# EAGLE design ethernet_io (EAGLE 5.11)

## Sheet 1 of 2
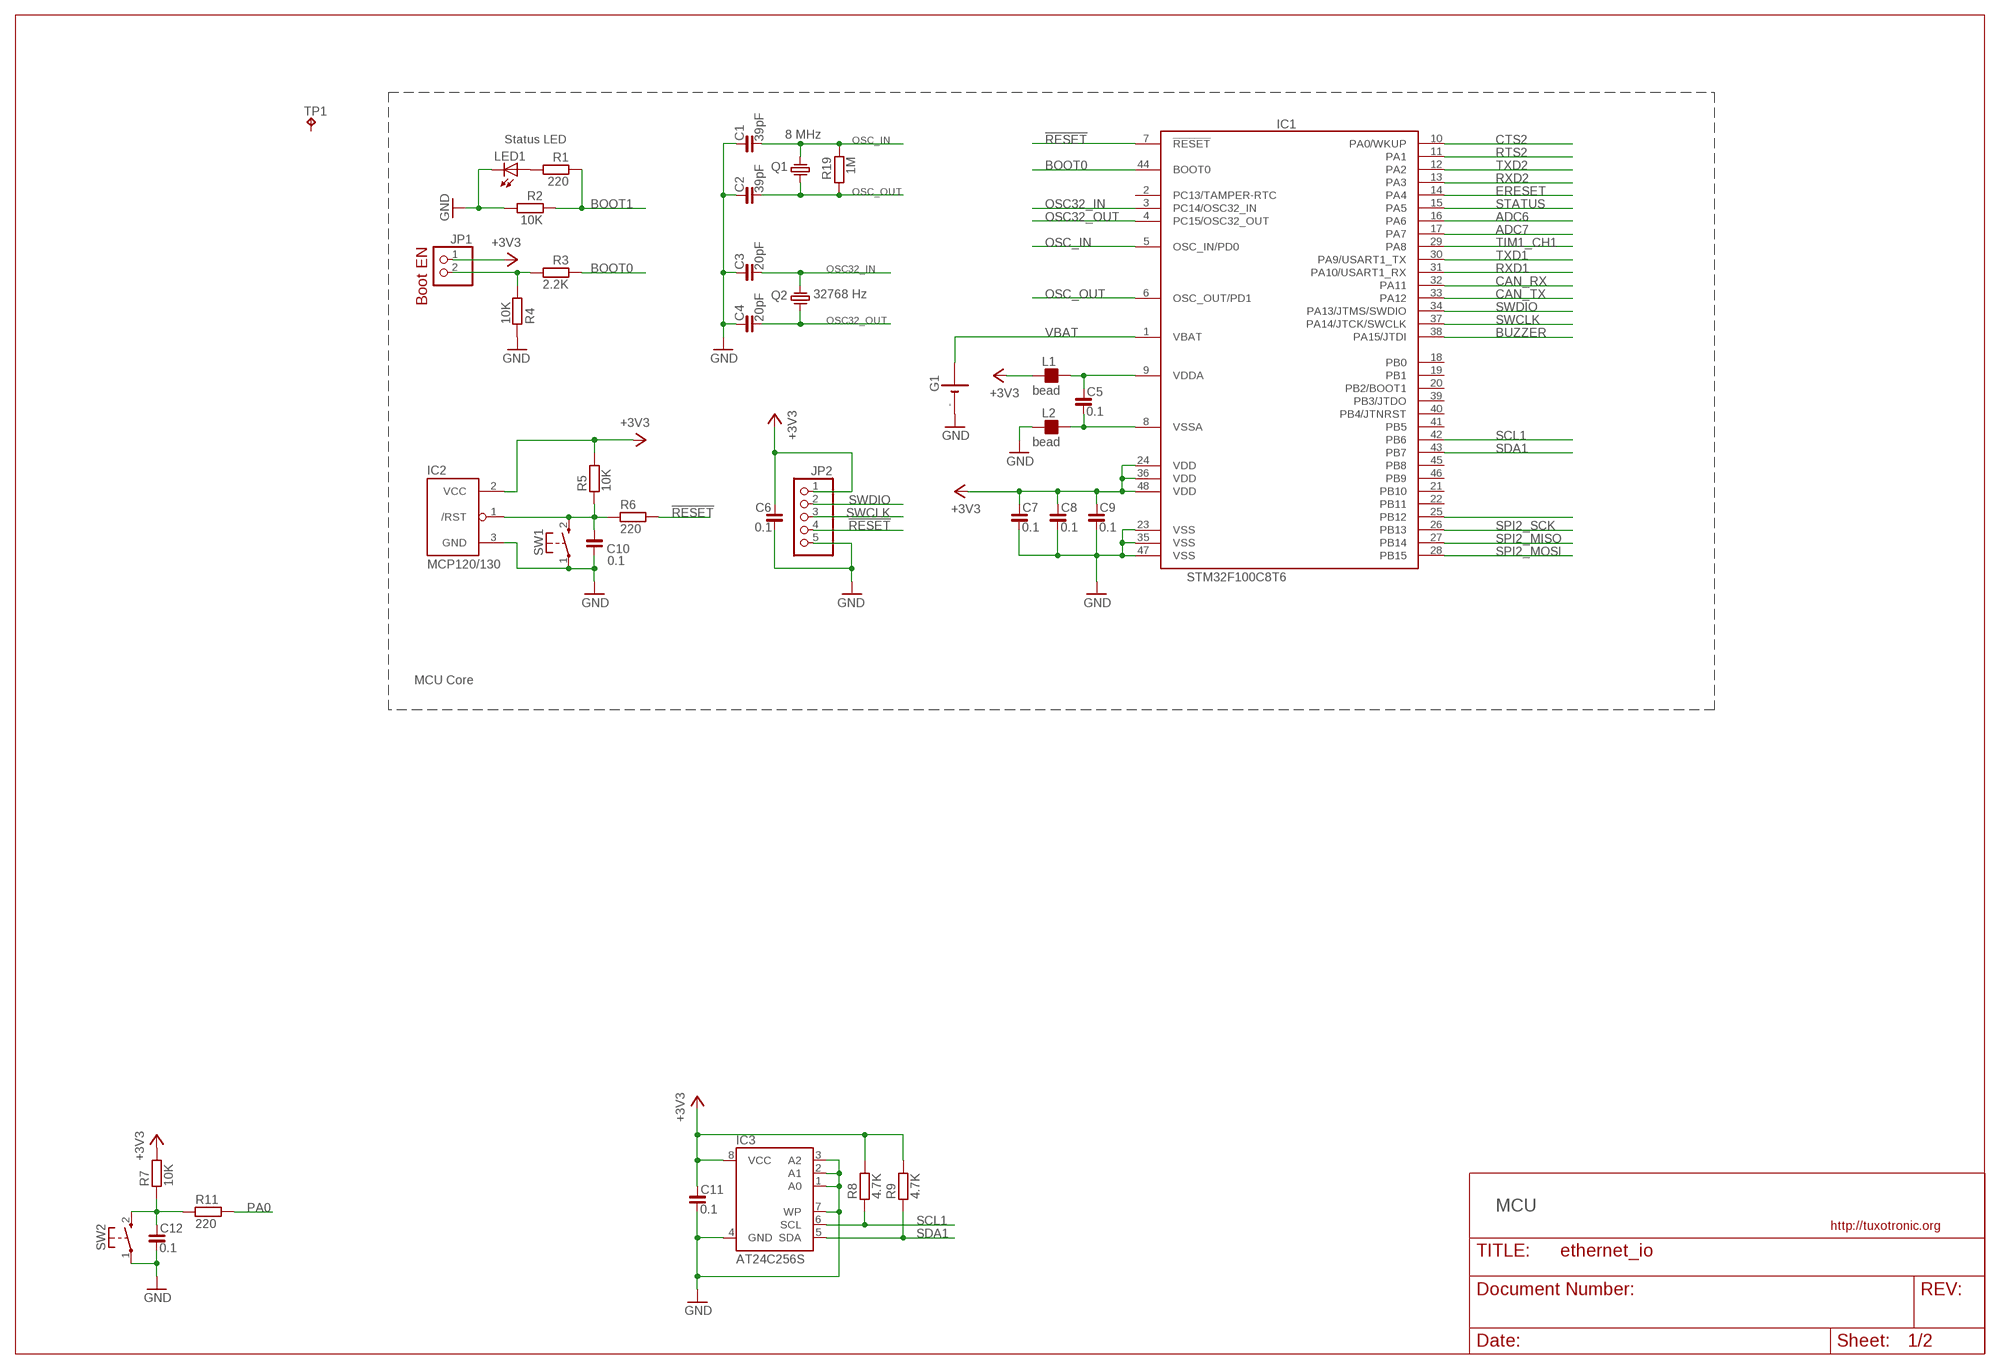
[diagram p0: schematic, sheet 1]

### Parts
C1  39pF  C_0603  [C0603]
C2  39pF  C_0603  [C0603]
C3  20pF  C_0603  [C0603]
C4  20pF  C_0603  [C0603]
C5  0.1  C_0603  [C0603]
C6  0.1  C_0603  [C0603]
C7  0.1  C_0603  [C0603]
C8  0.1  C_0603  [C0603]
C9  0.1  C_0603  [C0603]
C10  0.1  C_0603  [C0603]
C11  0.1  C_0603  [C0603]
C12  0.1  C_0603  [C0603]
G1  LI3VHOLDER  [LITHOLDER]
IC1  STM32F100C8T6  STM32F103C8T6  [LQFP48]
IC2  MCP120/130  [SOT23]
IC3  AT24C256S  [SO08]
JP1  PINHD-1X2_2.00  [1X02M]
JP2  PINHD-1X5_2.00  [1X05M]
L1  bead  FB_0603  [L0603]
L2  bead  FB_0603  [L0603]
LED1  LEDCHIP-LED0805  [CHIP-LED0805]
Q1  8 MHz  CRYSTAL-HC49S  [HC49/S]
Q2  32768 Hz  CRYSTAL-TC38H  [TC38H]
R1  220  R_0603  [R0603]
R2  10K  R_0603  [R0603]
R3  2.2K  R_0603  [R0603]
R4  10K  R_0603  [R0603]
R5  10K  R_0603  [R0603]
R6  220  R_0603  [R0603]
R7  10K  R_0603  [R0603]
R8  4.7K  R_0603  [R0603]
R9  4.7K  R_0603  [R0603]
R11  220  R_0603  [R0603]
R19  1M  R_0603  [R0603]
SW1  KSS-2EG4430  [KSS-2EG4430]
SW2  KSS-2EG4430  [KSS-2EG4430]
TP1  TPB1,27  [B1,27]

### Nets
!RESET: IC1.7(!RESET) JP2.4 R6.2
+3V3: C6.1 C7.1 C8.1 C9.1 C11.1 IC1.24(VDD) IC1.36(VDD) IC1.48(VDD) IC2.2(VCC) IC3.8(VCC) JP1.1 JP2.1 L1.1 R5.2 R7.2 R8.2 R9.2 ; also sheet 2
ADC6: IC1.16(PA6)
ADC7: IC1.17(PA7)
BOOT0: IC1.44(BOOT0) R3.1
BOOT1: R1.1 R2.1
BUZZER: IC1.38(PA15/JTDI)
CAN_RX: IC1.32(PA11) ; also sheet 2
CAN_TX: IC1.33(PA12) ; also sheet 2
CTS2: IC1.10(PA0/WKUP) ; also sheet 2
ERESET: IC1.14(PA4) ; also sheet 2
GND: C1.1 C2.1 C3.1 C4.1 C6.2 C7.2 C8.2 C9.2 C10.2 C11.2 C12.2 G1.- IC1.23(VSS) IC1.35(VSS) IC1.47(VSS) IC2.3(GND) IC3.1(A0) IC3.2(A1) IC3.3(A2) IC3.4(GND) IC3.7(WP) JP2.5 L2.1 LED1.C R2.2 R4.1 SW1.1(P) SW2.1(P) ; also sheet 2
N$11: C10.1 IC2.1(/RST) R5.1 R6.1 SW1.2(S)
N$12: JP1.2 R3.2 R4.2
N$14: IC1.25(PB12)
N$17: C12.1 R7.1 R11.1 SW2.2(S)
N$30: LED1.A R1.2
OSC32_IN: C3.2 IC1.3(PC14/OSC32_IN) Q2.2
OSC32_OUT: C4.2 IC1.4(PC15/OSC32_OUT) Q2.1
OSC_IN: C1.2 IC1.5(OSC_IN/PD0) Q1.2 R19.1
OSC_OUT: C2.2 IC1.6(OSC_OUT/PD1) Q1.1 R19.2
PA0: R11.2
RTS2: IC1.11(PA1) ; also sheet 2
RXD1: IC1.31(PA10/USART1_RX) ; also sheet 2
RXD2: IC1.13(PA3) ; also sheet 2
SCL1: IC1.42(PB6) IC3.6(SCL) R8.1
SDA1: IC1.43(PB7) IC3.5(SDA) R9.1
SPI2_MISO: IC1.27(PB14)
SPI2_MOSI: IC1.28(PB15)
SPI2_SCK: IC1.26(PB13)
STATUS: IC1.15(PA5) ; also sheet 2
SWCLK: IC1.37(PA14/JTCK/SWCLK) JP2.3
SWDIO: IC1.34(PA13/JTMS/SWDIO) JP2.2
TIM1_CH1: IC1.29(PA8)
TXD1: IC1.30(PA9/USART1_TX) ; also sheet 2
TXD2: IC1.12(PA2) ; also sheet 2
VBAT: G1.+ IC1.1(VBAT)
VDDA: C5.1 IC1.9(VDDA) L1.2
VSSA: C5.2 IC1.8(VSSA) L2.2
Unconnected: IC1.2(PC13/TAMPER-RTC) IC1.18(PB0) IC1.19(PB1) IC1.20(PB2/BOOT1) IC1.21(PB10) IC1.22(PB11) IC1.39(PB3/JTDO) IC1.40(PB4/JTNRST) IC1.41(PB5) IC1.45(PB8) IC1.46(PB9) TP1.PP(TP)

### Notes on the sheet
- Status LED
- Boot EN
- MCU Core
- MCU

## Sheet 2 of 2
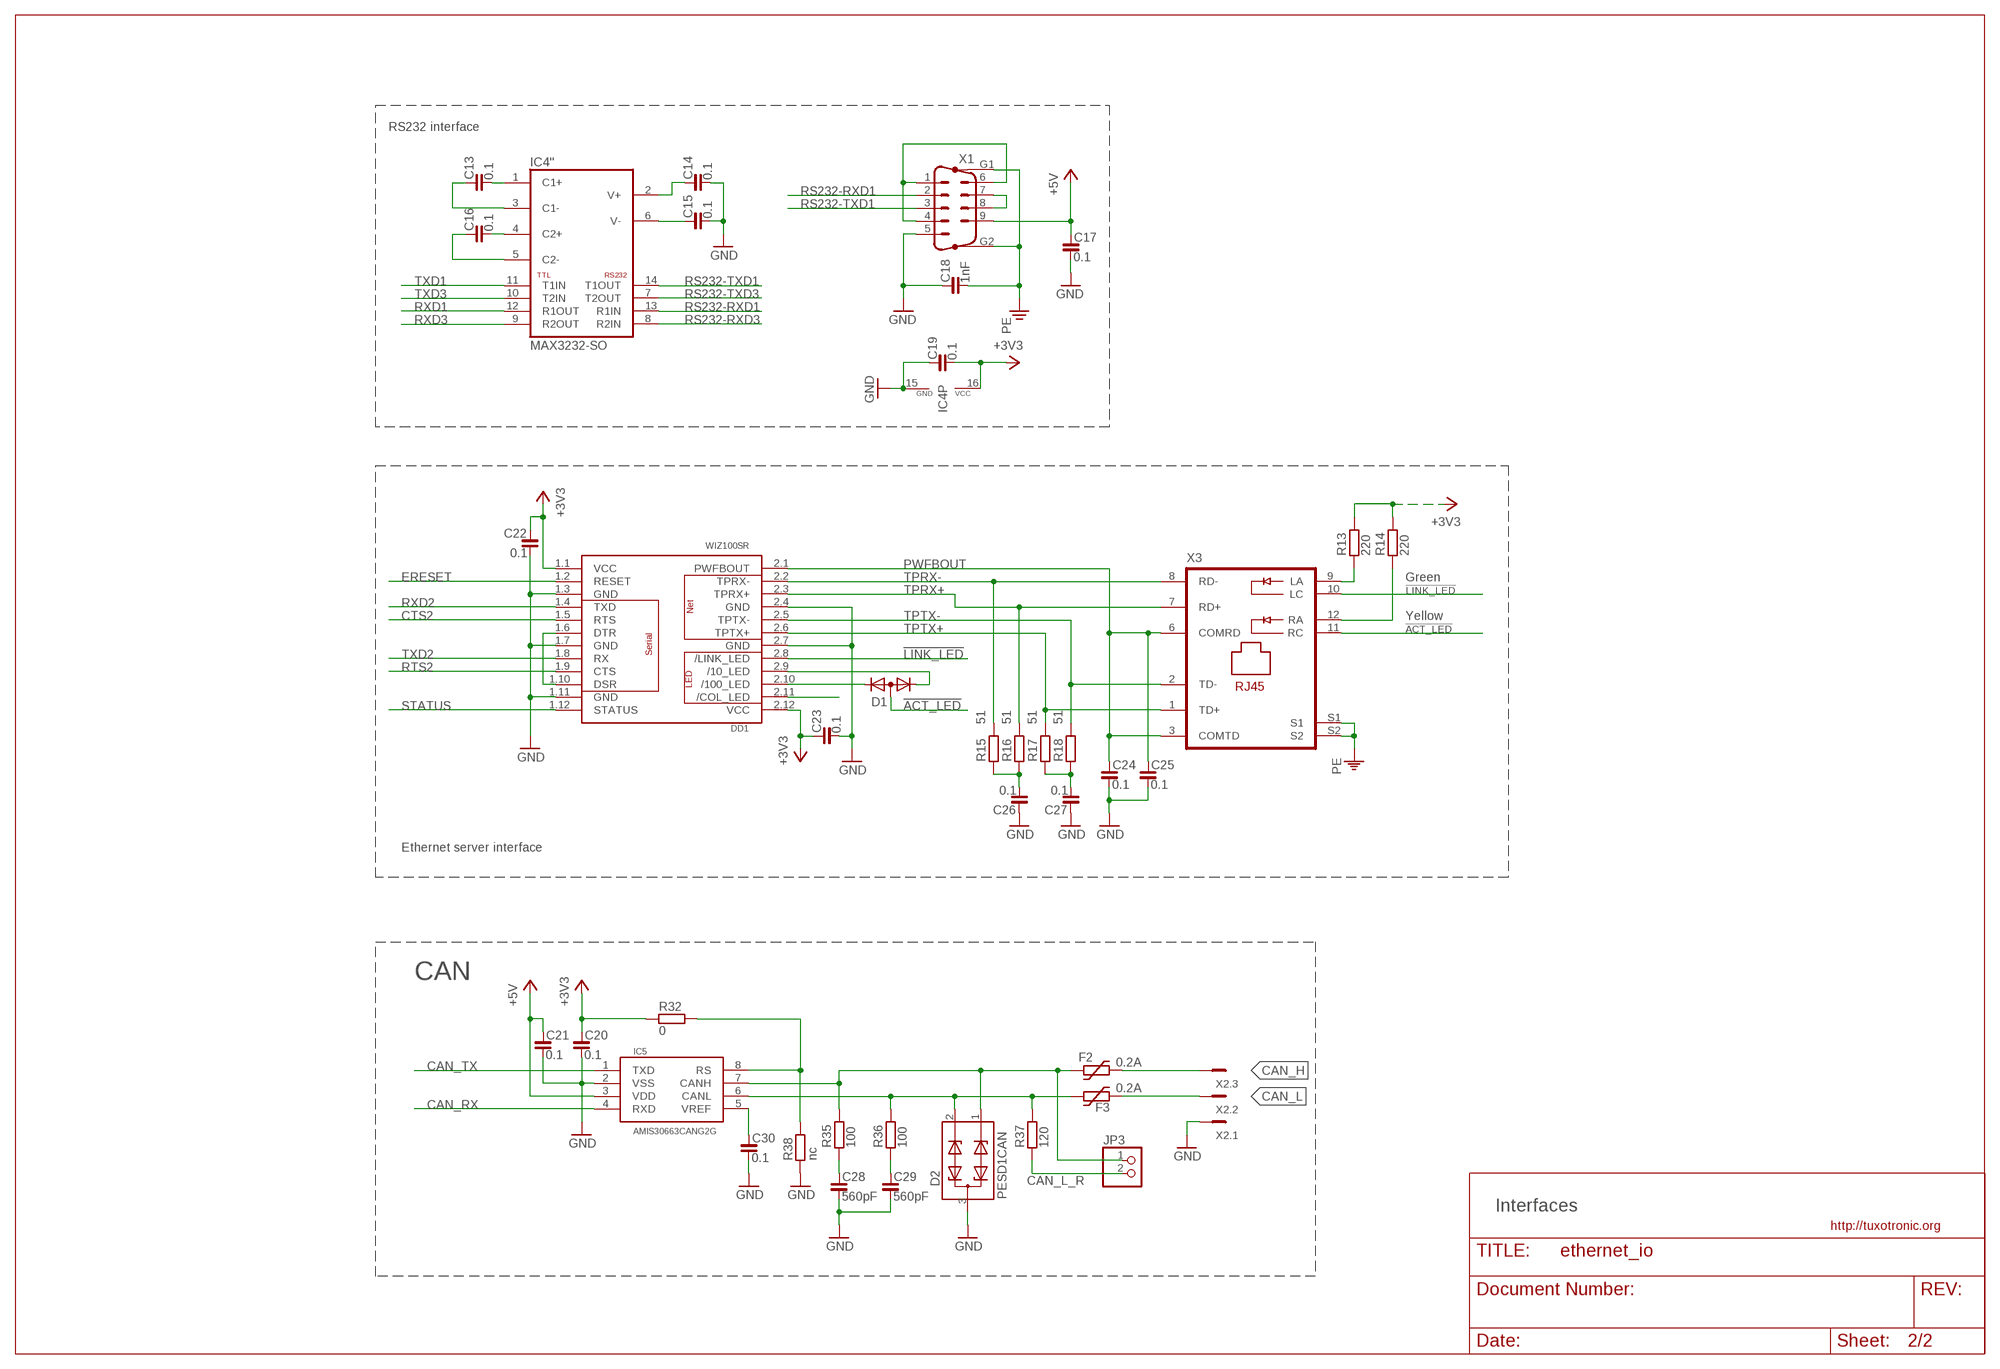
[diagram p1: schematic, sheet 2]

### Parts
C13  0.1  C_0603  [C0603]
C14  0.1  C_0603  [C0603]
C15  0.1  C_0603  [C0603]
C16  0.1  C_0603  [C0603]
C17  0.1  C_0805  [C0805]
C18  1nF  C_1206  [C1206]
C19  0.1  C_0603  [C0603]
C20  0.1  C_0603  [C0603]
C21  0.1  C_0603  [C0603]
C22  0.1  C_0603  [C0603]
C23  0.1  C_0603  [C0603]
C24  0.1  C_0603  [C0603]
C25  0.1  C_0603  [C0603]
C26  0.1  C_0603  [C0603]
C27  0.1  C_0603  [C0603]
C28  560pF  C_0603  [C0603]
C29  560pF  C_0603  [C0603]
C30  0.1  C_0603  [C0603]
D1  DIODE_CA-AC__  [SOT23C]
D2  PESD1CAN  [SOT23]
DD1  WIZ100SR  [WIZ100SR]
F2  0.2A  1812L  [1812L]
F3  0.2A  1812L  [1812L]
IC4  MAX3232-SO  MAX232-SO  [SO16]
IC5  AMIS30663CANG2G  SN65HVD230  [SO08]
JP3  PINHD-1X2_2.00  [1X02M]
R13  220  R_0603  [R0603]
R14  220  R_0603  [R0603]
R15  51  R_0603  [R0603]
R16  51  R_0603  [R0603]
R17  51  R_0603  [R0603]
R18  51  R_0603  [R0603]
R32  0  R_0603  [R0603]
R35  100  R_0603  [R0603]
R36  100  R_0603  [R0603]
R37  120  R_0805  [R0805]
R38  nc  R_0603  [R0603]
X1  M09HP-9.4  [M09HP]
X2  MC3  [MC3]
X3  LU1T516-43-LF  [PJ-J0]

### Nets
!ACT_LED: D1.3(A) X3.11(RC)
!LINK_LED: DD1.2.8(/LINK_LED) X3.10(LC)
+3V3: C19.2 C20.1 C22.1 C23.1 DD1.1.1(VCC) DD1.2.12(VCC) IC4.16(P:VCC) R13.2 R14.2 R32.1 ; also sheet 1
+5V: C17.1 C21.1 IC5.3(VDD) X1.9
CAN_CTRL: IC5.8(RS) R32.2 R38.2
CAN_H: F2.P$2 X2.3
CAN_L: F3.P$2 X2.2
CAN_L_R: JP3.2 R37.1
CAN_RX: IC5.4(RXD) ; also sheet 1
CAN_TX: IC5.1(TXD) ; also sheet 1
CTS2: DD1.1.5(RTS) ; also sheet 1
ERESET: DD1.1.2(RESET) ; also sheet 1
GND: C14.2 C15.2 C17.2 C18.1 C19.1 C20.2 C21.2 C22.2 C23.2 C24.2 C25.2 C26.1 C27.1 C28.2 C29.2 C30.2 D2.3 DD1.1.3(GND) DD1.1.7(GND) DD1.1.11(GND) DD1.2.4(GND) DD1.2.7(GND) IC4.15(P:GND) IC5.2(VSS) R38.1 X1.5 X2.1 ; also sheet 1
N$1: C26.2 R15.1 R16.1
N$2: C27.2 R17.1 R18.1
N$3: D1.2(K2) DD1.2.9(/10_LED)
N$4: D1.1(K1) DD1.2.10(/100_LED)
N$5: X1.7 X1.8
N$6: X1.1 X1.4 X1.6
N$9: R13.1 X3.9(LA)
N$10: R14.1 X3.12(RA)
N$15: DD1.1.6(DTR) DD1.1.10(DSR)
N$16: DD1.2.11(/COL_LED)
N$18: C30.1 IC5.5(VREF)
N$51: D2.1 F2.P$1 IC5.7(CANH) JP3.1 R35.2
N$52: D2.2 F3.P$1 IC5.6(CANL) R36.2 R37.2
N$54: C29.1 R36.1
N$55: C28.1 R35.1
N$80: C14.1 IC4.2('':V+)
N$81: C15.1 IC4.6('':V-)
N$82: C16.1 IC4.5('':C2-)
N$83: C16.2 IC4.4('':C2+)
N$84: C13.1 IC4.3('':C1-)
N$85: C13.2 IC4.1('':C1+)
PE: C18.2 X1.G1 X1.G2 X3.S1 X3.S2
PWFBOUT: C24.1 C25.1 DD1.2.1(PWFBOUT) X3.3(COMTD) X3.6(COMRD)
RS232-RXD1: IC4.13('':R1IN) X1.2
RS232-RXD3: IC4.8('':R2IN)
RS232-TXD1: IC4.14('':T1OUT) X1.3
RS232-TXD3: IC4.7('':T2OUT)
RTS2: DD1.1.9(CTS) ; also sheet 1
RXD1: IC4.12('':R1OUT) ; also sheet 1
RXD2: DD1.1.4(TXD) ; also sheet 1
RXD3: IC4.9('':R2OUT)
STATUS: DD1.1.12(STATUS) ; also sheet 1
TPRX+: DD1.2.3(TPRX+) R16.2 X3.7(RD+)
TPRX-: DD1.2.2(TPRX-) R15.2 X3.8(RD-)
TPTX+: DD1.2.6(TPTX+) R17.2 X3.1(TD+)
TPTX-: DD1.2.5(TPTX-) R18.2 X3.2(TD-)
TXD1: IC4.11('':T1IN) ; also sheet 1
TXD2: DD1.1.8(RX) ; also sheet 1
TXD3: IC4.10('':T2IN)

### Notes on the sheet
- RS232 interface
- Green
- Yellow
- Ethernet server interface
- CAN
- Interfaces

## Library data of the parts
C1-C30 = rc-master-smd:C_: NON-POLARIZED CAP
D1 = semicon-smd-ipc:DIODE_CA-AC_: DUAL DIODE
D2 = protect:PESD1CAN: Features Due to the integrated diode structure only one small SOT23 package is needed to protect two CAN bus lines Max. peak pulse power: PPP = 200 W at tp = 8/20 ?s Low clamping voltage: VCL = 40 V at IPP = 1 A Ultra low leakage current: IRM < 1 nA ESD protection up to 23 kV IEC 61000-4-2, level 4 (ESD) IEC 61000-4-5 (surge); IPP = 3 A at tp = 8/20 ?s Small SMD plastic package Applications CAN bus protection Automotive applications
DD1 = wiznet:WIZ100SR: Ethernet to Serial mezzanine module
F2 F3 = discrete:1812L
G1 = battery:LI3VHOLDER
IC1 = stm32-2:STM32F103C: Medium-density performance line ARM-based 32-bit MCU with 64 or 128 KB Flash, USB, CAN, 7 timers, 2 ADCs, 9 communication interfaces
IC2 = mcp120-130:MCP120/130
IC3 = stm32-by-pb:AT24C*: 2-wire serial EEPROM
IC4 = rs232-rs485:MAX232: RS232 TRANSEIVER
IC5 = interfaces:SN65HVD230: CAN PHY driver
JP1 JP3 = pinhead-fixdrills:PINHD-1X2: PIN HEADER
JP2 = pinhead-fixdrills:PINHD-1X5: PIN HEADER
L1 L2 = rc-master-smd:FB_: FERRITE BEAD
LED1 = led:LED: LED OSRAM: - CHIPLED LG R971, LG N971, LY N971, LG Q971, LY Q971, LO R971, LY R971 LH N974, LH R974 LS Q976, LO Q976, LY Q976 LO Q996 - Hyper CHIPLED LW Q18S LB Q993, LB Q99A, LB R99A - SideLED LS A670, LO A670, LY A670, LG A670, LP A670 LB A673, LV A673, LT A673, LW A673 LH A674 LY A675 LS A676, LA A676, LO A676, LY A676, LW A676 LS A679, LY A679, LG A679 - Hyper Micro SIDELED® LS Y876, LA Y876, LO Y876, LY Y876 LT Y87S - SmartLED LW L88C, LW L88S LB L89C, LB L89S, LG L890 LS L89K, LO L89K, LY L89K LS L896, LA L896, LO L896, LY L896 - TOPLED LS T670, LO T670, LY T670, LG T670, LP T670 LSG T670, LSP T670, LSY T670, LOP T670, LYG T670 LG T671, LOG T671, LSG T671 LB T673, LV T673, LT T673, LW T673 LH T674 LS T676, LA T676, LO T676, LY T676, LB T676, LH T676, LSB T676, LW T676 LB T67C, LV T67C, LT T67C, LS T67K, LO T67K, LY T67K, LW E67C LS E67B, LA E67B, LO E67B, LY E67B, LB E67C, LV E67C, LT E67C LW T67C LS T679, LY T679, LG T679 LS T770, LO T770, LY T770, LG T770, LP T770 LB T773, LV T773, LT T773, LW T773 LH T774 LS E675, LA E675, LY E675, LS T675 LS T776, LA T776, LO T776, LY T776, LB T776 LHGB T686 LT T68C, LB T68C - Hyper Mini TOPLED® LB M676 - Mini TOPLED Santana® LG M470 LS M47K, LO M47K, LY M47K Source: http://www.osram.convergy.de - LUMILED® LXK2-PW12-R00, LXK2-PW12-S00, LXK2-PW14-U00, LXK2-PW14-V00 LXK2-PM12-R00, LXK2-PM12-S00, LXK2-PM14-U00 LXK2-PE12-Q00, LXK2-PE12-R00, LXK2-PE12-S00, LXK2-PE14-T00, LXK2-PE14-U00 LXK2-PB12-K00, LXK2-PB12-L00, LXK2-PB12-M00, LXK2-PB14-N00, LXK2-PB14-P00, LXK2-PB14-Q00 LXK2-PR12-L00, LXK2-PR12-M00, LXK2-PR14-Q00, LXK2-PR14-R00 LXK2-PD12-Q00, LXK2-PD12-R00, LXK2-PD12-S00 LXK2-PH12-R00, LXK2-PH12-S00 LXK2-PL12-P00, LXK2-PL12-Q00, LXK2-PL12-R00 Source: www.luxeon.com
Q1 Q2 = crystal:CRYSTAL-: CRYSTAL
R1-R9 R11 R13-R19 R32 R35-R38 = rc-master-smd:R_: RESISTOR
SW1 SW2 = buttons:KSS-2EG4430: Size: 3x6mm Height: 5mm from PCB Rating: DC12v 50mA Travel: 0.25±0.10mm Operating Force: 180±50gf Return Force: 60gf min Contact resistance: 100m? max Insulation resistance: 100M? min Operating life?50,000 cycles
TP1 = testpad:TP: Test pad
X1 = sub-d:M09HP: SUB-D
X2 = con-phoenix-381_l:MC3: Mini-Combicon 3.81mm horizontal 3-polig (ohne Gegenstecker)
X3 = con-magjack:LU1T516-43-LF: 8P8C (RJ-45) MagJack connector Can be replaced with LU1T041X

## Net classes
0 default: width 0.1 mm, drill 0.1 mm, clearance 0.1 mm

## Board
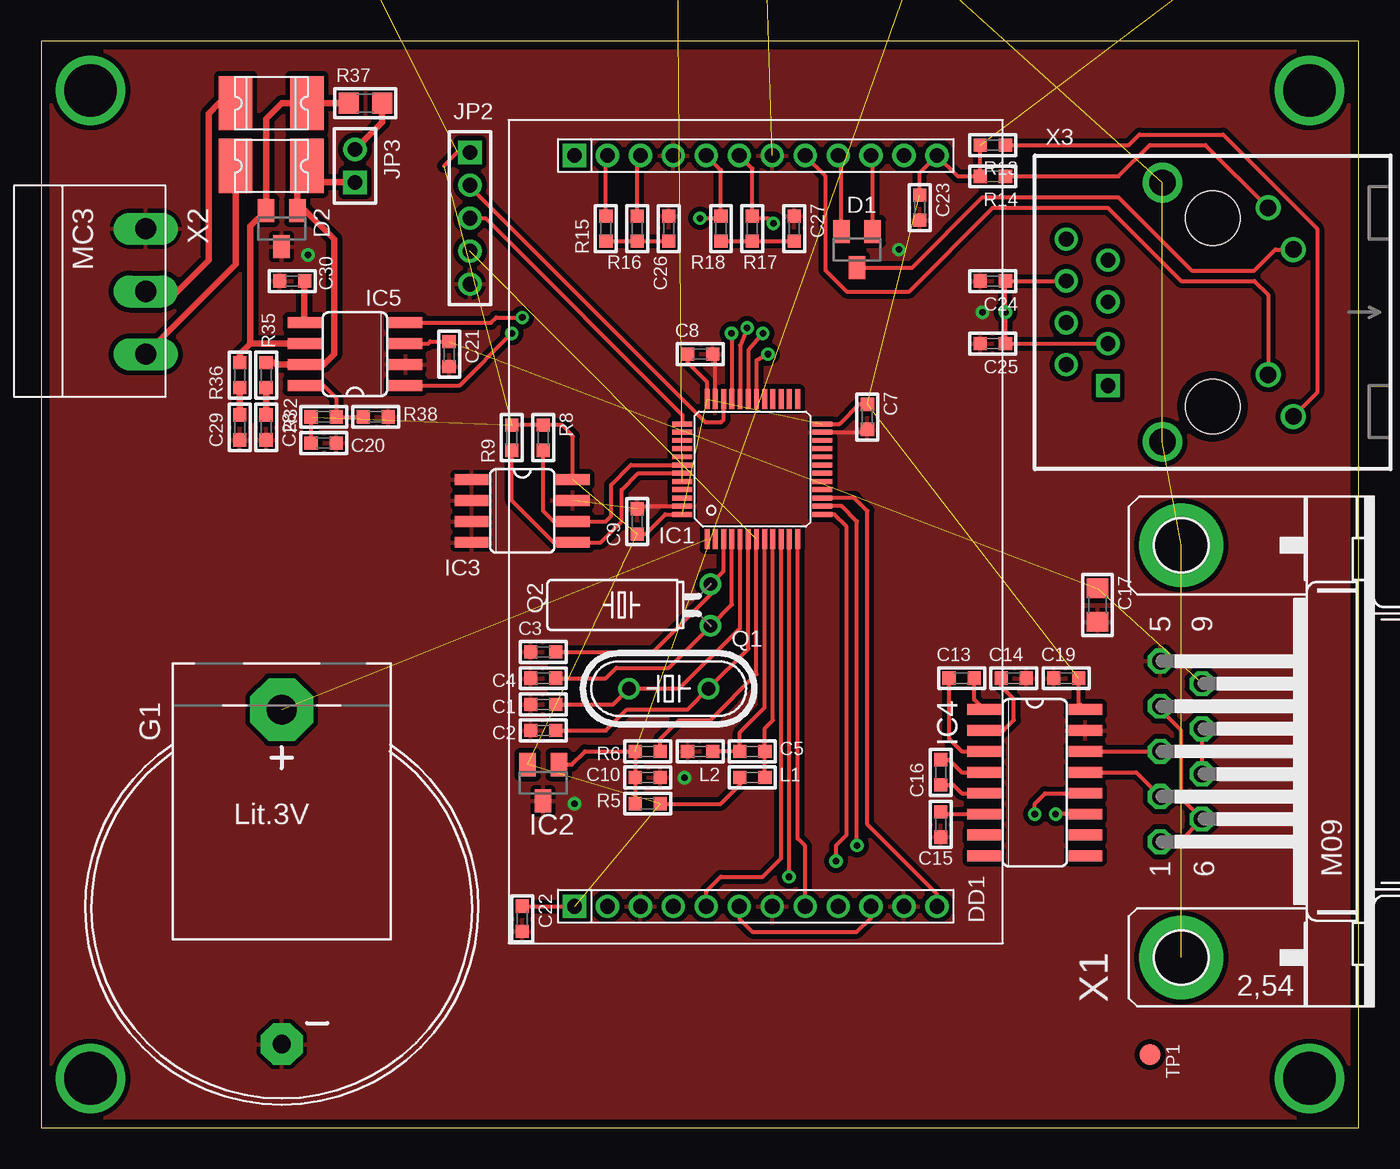
[diagram p2: board, top side]
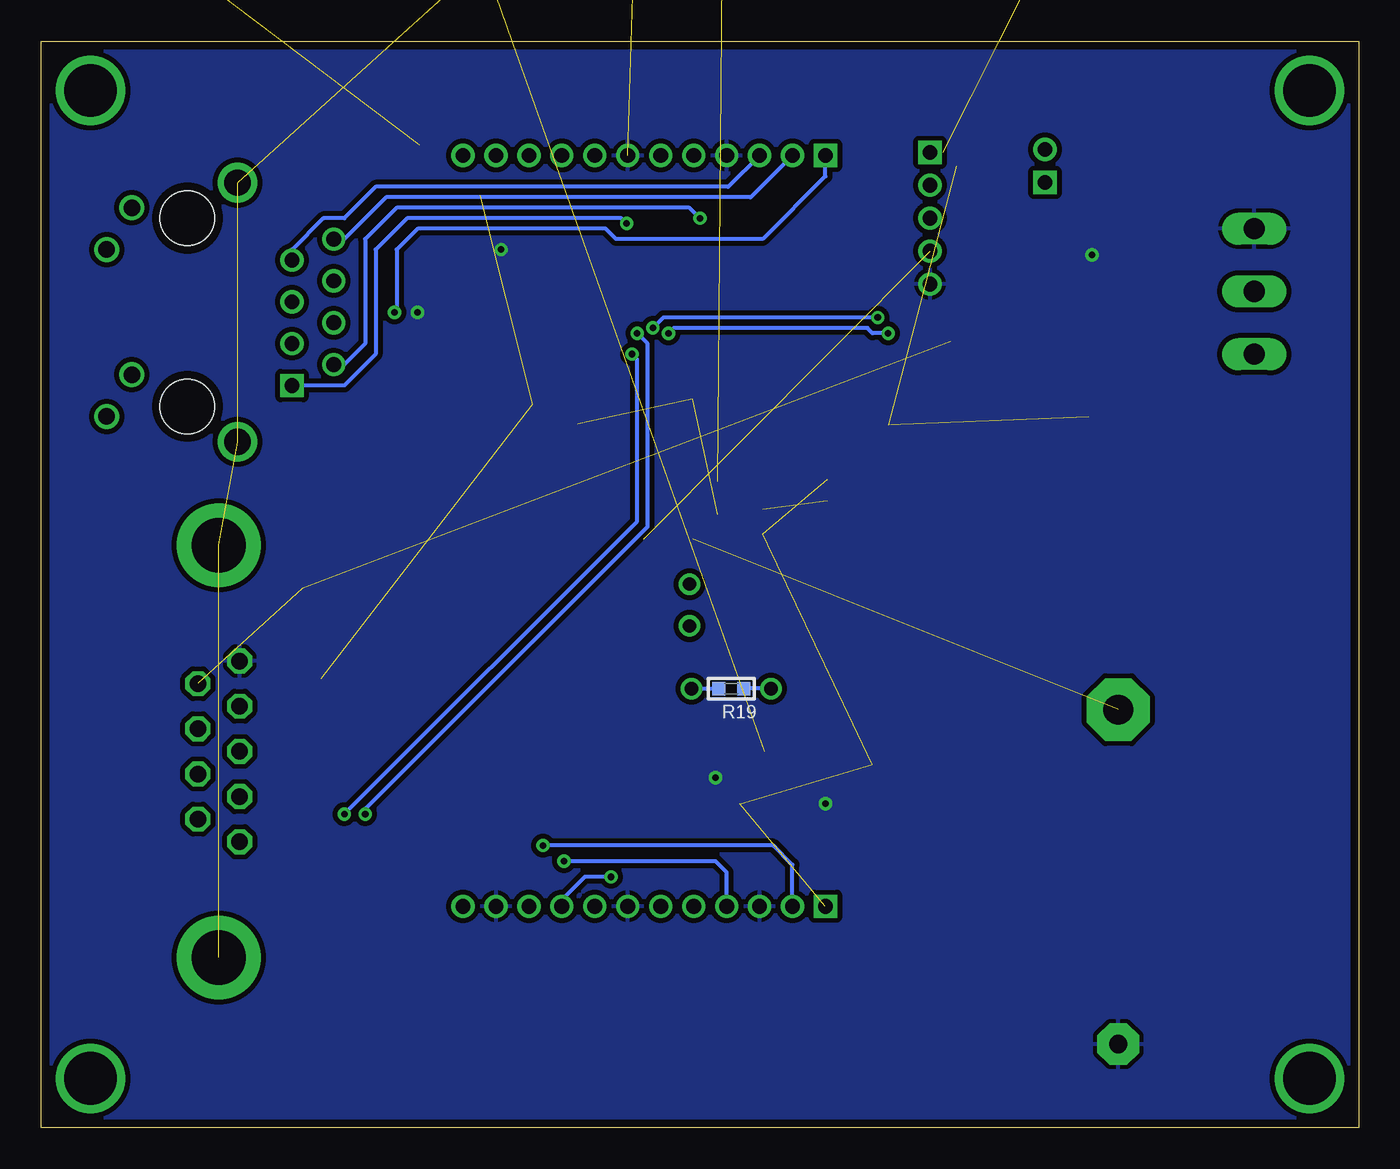
[diagram p3: board, bottom side, seen from below]

Size 80 x 66 mm. Coordinates in mm from the lower left corner, seen from the top.
Outline: 0,0 80,0 80,66 0,66 0,0
Copper layers (1*16): Top 0.018mm / dielectric 1.5mm / Bottom 0.018mm
Design rules "resonit-18mkm": minimum track width 0.16mm, minimum drill 0.4mm, track to track 0.16mm, track to pad 0.16mm, pad to pad 0.16mm, via to via 0.16mm, smd to smd 0.16mm, copper to edge 0.5mm, drill to drill 8mil, minimum pad ring 10mil, minimum via ring 8mil, stop-mask expansion 4mil, vias tented up to drill 0.5mm, thermal gap 10mil

### Footprints (pad centres in the part's own frame; a part is rotated, then mirrored left to right if it is on the bottom)
C0603 = smd 0.8 x 0.8: 1 -0.762,0; 2 0.762,0
C0805 = smd 1.2 x 1.3: 1 -1.016,0; 2 1.016,0
C1206 = smd 1.3 x 1.6: 1 -1.524,0; 2 1.524,0
SOT23C = smd 1 x 1.4: 1 -0.95,-1.1; 2 0.95,-1.1; 3 0,1.1
SOT23 = smd 1 x 1.4: 1 -0.95,-1.1; 2 0.95,-1.1; 3 0,1.1
WIZ100SR = drill 0.9 square: 1.1 45.6,0; 2.1 0,0 | drill 0.9 round: 1.2 45.6,2; 1.3 45.6,4; 1.4 45.6,6; 1.5 45.6,8; 1.6 45.6,10; 1.7 45.6,12; 1.8 45.6,14; 1.9 45.6,16; 1.10 45.6,18; 1.11 45.6,20; 1.12 45.6,22; 2.2 0,2; 2.3 0,4; 2.4 0,6; 2.5 0,8; 2.6 0,10; 2.7 0,12; 2.8 0,14; 2.9 0,16; 2.10 0,18; 2.11 0,20; 2.12 0,22
1812L = smd 2.03 x 3.3: P$1 -2.16,0; P$2 2.16,0
LITHOLDER = drill 1.803 pad 3.81 octagon: + 0,12.065 | drill 1.118 pad 2.54 octagon: - 0,-8.255
LQFP48 = smd 0.3 x 1.2: 1 -2.75,-4.25; 2 -2.25,-4.25; 3 -1.75,-4.25; 4 -1.25,-4.25; 5 -0.75,-4.25; 6 -0.25,-4.25; 7 0.25,-4.25; 8 0.75,-4.25; 9 1.25,-4.25; 10 1.75,-4.25; 11 2.25,-4.25; 12 2.75,-4.25; 25 2.75,4.25; 26 2.25,4.25; 27 1.75,4.25; 28 1.25,4.25; 29 0.75,4.25; 30 0.25,4.25; 31 -0.25,4.25; 32 -0.75,4.25; 33 -1.25,4.25; 34 -1.75,4.25; 35 -2.25,4.25; 36 -2.75,4.25 | smd 1.2 x 0.3: 13 4.25,-2.75; 14 4.25,-2.25; 15 4.25,-1.75; 16 4.25,-1.25; 17 4.25,-0.75; 18 4.25,-0.25; 19 4.25,0.25; 20 4.25,0.75; 21 4.25,1.25; 22 4.25,1.75; 23 4.25,2.25; 24 4.25,2.75; 37 -4.25,2.75; 38 -4.25,2.25; 39 -4.25,1.75; 40 -4.25,1.25; 41 -4.25,0.75; 42 -4.25,0.25; 43 -4.25,-0.25; 44 -4.25,-0.75; 45 -4.25,-1.25; 46 -4.25,-1.75; 47 -4.25,-2.25; 48 -4.25,-2.75
SO08 = smd 0.66 x 2.032: 1 -1.905,-3.073; 2 -0.635,-3.073; 3 0.635,-3.073; 4 1.905,-3.073; 5 1.905,3.073; 6 0.635,3.073; 7 -0.635,3.073; 8 -1.905,3.073
SO16 = smd 0.66 x 2.032: 1 -4.445,-3.073; 2 -3.175,-3.073; 3 -1.905,-3.073; 4 -0.635,-3.073; 5 0.635,-3.073; 6 1.905,-3.073; 7 3.175,-3.073; 8 4.445,-3.073; 9 4.445,3.073; 10 3.175,3.073; 11 1.905,3.073; 12 0.635,3.073; 13 -0.635,3.073; 14 -1.905,3.073; 15 -3.175,3.073; 16 -4.445,3.073
1X02M = drill 0.9 square: 1 -1,0 | drill 0.9 round: 2 1,0
1X05M = drill 0.9 square: 1 -4,0 | drill 0.9 round: 2 -2,0; 3 0,0; 4 2,0; 5 4,0
L0603 = smd 0.8 x 0.8: 1 -0.762,0; 2 0.762,0
CHIP-LED0805 = smd 1.2 x 1.2: A 0,-1.05; C 0,1.05
HC49/S = drill 0.8 round: 1 -2.413,0; 2 2.413,0
TC38H = drill 0.8 round: 1 -1.27,0; 2 1.27,0
R0603 = smd 0.8 x 0.8: 1 -0.762,0; 2 0.762,0
R0805 = smd 1.2 x 1.3: 1 -1.016,0; 2 1.016,0
KSS-2EG4430 = smd 1.6 x 1.4: 1 -3.75,0; 2 3.75,0
B1,27 = smd 1.27 x 1.27: PP 0,0
M09HP = drill 1 octagon: 1 -5.486,1.27; 2 -2.743,1.27; 3 0,1.27; 4 2.743,1.27; 5 5.486,1.27; 6 -4.115,-1.27; 7 -1.372,-1.27; 8 1.372,-1.27; 9 4.115,-1.27 | drill 3.3 pad 5.08 round: G1 -12.522,0; G2 12.522,0
MC3 = drill 1.3 long: 1 -3.81,0; 2 0,0; 3 3.81,0
PJ-J0 = drill 0.9 square: 1 4.445,-6.35 | drill 0.9 round: 2 3.175,-8.89; 3 1.905,-6.35; 4 0.635,-8.89; 5 -0.635,-6.35; 6 -1.905,-8.89; 7 -3.175,-6.35; 8 -4.445,-8.89 | drill 1 round: 9 6.325,4.902; 10 3.785,3.378; 11 -3.81,4.902; 12 -6.35,3.378 | drill 1.6 round: S1 -7.874,-3.048; S2 7.874,-3.048 | hole 3.3: -5.715,0; 5.715,0

### Placement (x,y rotation side)
C1  30.48,25.72 0 top
C2  30.48,24.13 0 top
C3  30.48,28.89 0 top
C4  30.48,27.3 0 top
C5  43.18,22.86 180 top
C6  15.88,79.38 0 top  (outside the outline)
C7  50.16,43.18 270 top
C8  40.01,46.99 0 top
C9  36.2,36.83 90 top
C10  36.83,21.27 0 top
C11  100.97,80.64 0 top  (outside the outline)
C12  89.53,80.64 0 top  (outside the outline)
C13  55.88,27.3 0 top
C14  59.05,27.3 0 top
C15  54.61,18.41 270 top
C16  54.61,21.59 90 top
C17  64.14,31.75 270 top
C18  38.73,82.55 0 top  (outside the outline)
C19  62.23,27.3 0 top
C20  17.14,41.59 0 top
C21  24.77,46.99 270 top
C22  29.21,12.7 270 top
C23  53.34,55.88 270 top
C24  57.78,51.44 180 top
C25  57.78,47.62 180 top
C26  38.1,54.61 270 top
C27  45.72,54.61 270 top
C28  13.65,42.55 270 top
C29  12.06,42.55 270 top
C30  15.24,51.44 180 top
D1  49.53,53.34 180 top
D2  14.61,54.61 180 top
DD1  32.38,59.05 270 top
F2  13.97,58.42 180 top
F3  13.97,62.23 180 top
G1  14.61,13.34 0 top
IC1  43.18,40.01 0 top
IC2  30.48,20.95 180 top
IC3  29.21,37.47 270 top
IC4  60.33,20.95 270 top
IC5  19.05,46.99 90 top
JP1  90.81,84.45 0 top  (outside the outline)
JP2  26.04,55.24 270 top
JP3  19.05,58.42 90 top
L1  43.18,21.27 0 top
L2  40.01,22.86 0 top
LED1  80.64,75.56 0 top  (outside the outline)
Q1  38.1,26.67 180 top
Q2  40.64,31.75 90 top
R1  27.94,73.66 0 top  (outside the outline)
R2  43.18,73.66 0 top  (outside the outline)
R3  39.37,73.66 0 top  (outside the outline)
R4  35.56,73.66 0 top  (outside the outline)
R5  36.83,19.68 0 top
R6  36.83,22.86 0 top
R7  29.84,84.45 0 top  (outside the outline)
R8  30.48,41.91 90 top
R9  28.57,41.91 90 top
R11  26.04,84.45 0 top  (outside the outline)
R13  57.78,59.69 180 top
R14  57.78,57.78 180 top
R15  34.29,54.61 90 top
R16  36.2,54.61 90 top
R17  43.18,54.61 90 top
R18  41.27,54.61 90 top
R19  38.1,26.67 180 bottom
R32  17.14,43.18 0 top
R35  13.65,45.72 90 top
R36  12.06,45.72 90 top
R37  19.68,62.23 180 top
R38  20.32,43.18 180 top
SW1  53.98,83.82 0 top  (outside the outline)
SW2  66.67,83.82 0 top  (outside the outline)
TP1  67.31,4.45 270 top
X1  69.22,22.86 90 top
X2  6.35,50.8 270 top
X3  71.12,49.53 270 top

### Tracks (layer width: path | path; a pad name or v marks a point on that pad's centre or on a via)
!ACT_LED
  Top 0.254: X3.11 74.93,53.34 73.66,52.07 69.85,52.07 65.41,56.52 57.15,56.52 52.88,52.24 D1.3
!LINK_LED
  Top 0.254: DD1.2.8 46.38,59.02 47.62,57.78 47.62,52.07 48.9,50.8 52.7,50.8 57.78,55.88 64.77,55.88 69.22,51.44 73.66,51.44 74.5,50.6 X3.10
!RESET  (1 unrouted)
  Top 0.254: IC1.7 43.43,27.55 40.64,24.77 38.73,24.77 37.59,23.62 R6.2
+3V3  (14 unrouted)
  Top 0.254: R13.2 R14.2 55.66,57.78 DD1.2.12 53.34,58.01 C23.1 | DD1.1.1 C22.1 | R9.2 R8.2 31.62,42.67 32.28,42.01 IC3.8 | JP2.1 25.27,59.24 24.45,58.42 | IC1.36 40.43,45.3 39.24,46.48 C8.1 | IC1.24 48.47,42.76 49.66,43.94 C7.1 | IC1.48 37.89,37.26 36.7,36.07 C9.1 | C19.2 62.99,25.81 IC4.16 | R5.2 41.27,19.68 42.42,20.83 L1.1 | C20.1 R32.1
+5V  (2 unrouted)
  Top 0.254: IC5.3 23.5,47.62 23.62,47.75 C21.1
BOOT0  (1 unrouted)
BOOT1  (1 unrouted)
CAN_CTRL
  Top 0.254: R38.2 R32.2 17.91,44.32 17.14,45.09 IC5.8
CAN_H
  Top 0.406: F2.P$2 11.81,52.45 X2.3
CAN_L
  Top 0.406: X2.2 8.26,50.8 10.16,52.7 10.16,61.59 10.79,62.23 F3.P$2
CAN_L_R
  Top 0.406: R37.1 20.7,61.07 JP3.2
CAN_RX  (via drill 0.4)
  Top 0.254: IC1.32 42.43,47.51 v42.86,48.58 | IC5.4 27.3,48.9 27.62,49.21 v29.21,49.21
  Bottom 0.254: v29.21,49.21 42.23,49.21 v42.86,48.58
CAN_TX  (via drill 0.4)
  Top 0.254: IC5.1 25.4,45.09 v28.57,48.26 | IC1.33 41.93,48.24 v41.91,48.26
  Bottom 0.254: v28.57,48.26 29.53,48.26 29.84,48.58 41.59,48.58 v41.91,48.26
CTS2
  Top 0.254: IC1.10 44.93,16.36 43.81,15.24 41.27,15.24 40.38,14.35 DD1.1.5
ERESET  (via drill 0.4)
  Top 0.254: IC1.14 48.6,37.76 49.53,36.83 v49.53,17.14
  Bottom 0.254: DD1.1.2 34.38,15.97 35.56,17.14 v49.53,17.14
GND  (via drill 0.4)  (10 unrouted)
  Top 0.254: IC1.35 40.93,46.83 C8.2 | IC1.23 50,42.26 C7.2 | IC1.47 36.36,37.76 C9.2
  other vias: 57.15,49.53 52.07,53.34 39.05,21.27 16.19,53.02 32.38,19.68
  pour Top (isolate 0.305, rank 4): -1.27,67.94 81.92,67.94 81.92,-1.27 -1.27,-1.27
  pour Bottom (isolate 0.305, rank 4): -1.27,67.94 81.92,67.94 81.92,-1.27 -1.27,-1.27
N$1
  Top 0.254: R15.1 R16.1 C26.2
N$2
  Top 0.254: R18.1 R17.1 C27.2
N$3
  Top 0.254: D1.2 48.58,58.86 DD1.2.9
N$4
  Top 0.254: D1.1 50.48,58.96 DD1.2.10
N$5
  Top 0.254: X1.7 X1.8
N$6
  Top 0.254: X1.4 67.94,25.4 69.22,24.13 69.22,20.02 X1.6 69.11,17.37 X1.1
N$7  (via drill 3.2)
  other vias: 77,3
N$8  (via drill 3.2)
  other vias: 77,63
N$9
  Top 0.254: R13.1 66.04,59.69 66.67,60.33 71.75,60.33 77.47,54.61 77.47,44.65 X3.9
N$10
  Top 0.254: R14.1 65.41,57.78 67.31,59.69 70.69,59.69 X3.12
N$11  (1 unrouted)
  Top 0.254: IC2.1 32.22,22.05 33.02,22.86 R6.1 C10.1 R5.1
N$12  (2 unrouted)
N$15
  Top 0.254: DD1.1.6 42.38,12.7 43.18,11.91 49.53,11.91 50.38,12.76 DD1.1.10
N$17  (3 unrouted)
N$18
  Top 0.406: IC5.5 15.98,51.41 C30.1
N$19  (via drill 3.2)
  other vias: 3,3
N$20  (via drill 3.2)
  other vias: 3,63
N$30  (1 unrouted)
N$51
  Top 0.406: JP3.1 17.13,57.42 F2.P$1 15.55,57.84 D2.1 16.05,55.71 17.78,53.98 17.78,46.99 17.14,46.35 IC5.7 14.29,46.35 14.16,46.48 R35.2
N$52
  Top 0.406: R37.2 F3.P$1 14.61,62.23 13.65,61.28 D2.2 12.7,54.76 12.7,47.62 | 12.7,47.62 IC5.6 | 12.7,47.62 12.06,46.99 R36.2
N$54
  Top 0.406: R36.1 C29.1
N$55
  Top 0.406: R35.1 C28.1
N$80
  Top 0.254: IC4.2 58.42,24.13 59.05,24.77 59.05,26.04 58.29,26.8 C14.1
N$81
  Top 0.254: IC4.6 54.74,19.05 C15.1
N$82
  Top 0.254: IC4.5 55.88,20.32 55.37,20.83 C16.1
N$83
  Top 0.254: IC4.4 55.88,21.59 55.12,22.35 C16.2
N$84
  Top 0.254: C13.1 55.12,23.62 55.88,22.86 IC4.3
N$85
  Top 0.254: C13.2 56.64,26.01 IC4.1
OSC32_IN
  Top 0.254: IC1.3 41.43,33.81 Q2.2 40.64,32.38 37.15,28.89 C3.2
OSC32_OUT
  Top 0.254: IC1.4 41.93,31.77 Q2.1 38.1,27.94 34.92,27.94 34.29,27.3 C4.2
OSC_IN
  Top 0.254: IC1.5 42.43,30.36 38.73,26.67 Q1.2 34.73,25.72 C1.2
  Bottom 0.254: Q1.2 R19.1
OSC_OUT
  Top 0.254: IC1.6 42.93,29.09 Q1.1 39.24,25.4 35.56,25.4 34.29,24.13 C2.2
  Bottom 0.254: Q1.1 R19.2
PE  (4 unrouted)
PWFBOUT  (via drill 0.4)
  Top 0.254: X3.3 C25.1 v58.55,49.53 C24.1 X3.6
  Bottom 0.254: DD1.2.1 32.38,57.78 36.2,53.98 45.09,53.98 45.72,54.61 57.15,54.61 58.42,53.34 58.42,49.66 v58.55,49.53
RS232-RXD1
  Top 0.254: IC4.13 66.47,21.59 X1.2
RS232-TXD1
  Top 0.254: IC4.14 X1.3
RTS2  (via drill 0.4)
  Top 0.254: IC1.11 45.43,15.27 v45.4,15.24
  Bottom 0.254: v45.4,15.24 46.99,15.24 48.38,13.85 DD1.1.9
RXD1  (via drill 0.4)
  Top 0.254: IC1.31 42.93,47.24 v43.81,48.26 | v60.33,19.05 60.33,19.68 60.96,20.32 IC4.12
  Bottom 0.254: v43.81,48.26 43.18,47.62 43.18,36.51 60.33,19.37 v60.33,19.05
RXD2  (via drill 0.4)
  Top 0.254: IC1.13 48.15,37.26 48.9,36.51 48.9,17.78 48.26,17.14 v48.26,16.19
  Bottom 0.254: v48.26,16.19 39.05,16.19 38.38,15.53 DD1.1.4
SCL1
  Top 0.254: R8.1 30.48,37.47 31.11,36.83 IC3.6 34.29,36.83 34.61,37.15 34.61,39.05 35.81,40.26 IC1.42
SDA1
  Top 0.254: R9.1 28.57,38.1 31.11,35.56 IC3.5 33.97,35.56 35.24,36.83 35.24,38.73 36.26,39.76 IC1.43
STATUS
  Top 0.254: DD1.1.12 54.38,14.2 50.16,18.41 50.16,37.47 49.38,38.26 IC1.15
SWCLK
  Top 0.254: IC1.37 38.93,43.3 26.99,55.24 JP2.3
SWDIO
  Top 0.254: IC1.34 41.43,43.02 41.27,42.86 40.32,42.86 26.04,57.15 JP2.2
TPRX+
  Top 0.254: R16.2 36.2,58.87 DD1.2.3
  Bottom 0.254: X3.7 64.77,53.34 62.87,55.24 61.59,55.24 59.69,57.15 38.29,57.15 DD1.2.3
TPRX-
  Top 0.254: R15.2 34.29,58.96 DD1.2.2
  Bottom 0.254: X3.8 61.59,53.98 59.05,56.52 36.92,56.52 DD1.2.2
TPTX+  (via drill 0.4)
  Top 0.254: DD1.2.6 43.18,58.26 R17.2 43.31,55.24 44.13,55.24 v44.45,54.93
  Bottom 0.254: X3.1 61.59,45.09 59.69,46.99 59.69,53.34 57.78,55.24 44.77,55.24 v44.45,54.93
TPTX-  (via drill 0.4)
  Top 0.254: DD1.2.5 41.27,58.16 R18.2 41.15,55.24 v40.01,55.24
  Bottom 0.254: X3.2 61.59,46.35 60.33,47.62 60.33,53.98 58.42,55.88 40.64,55.88 v40.01,55.24
TXD1  (via drill 0.4)
  Top 0.254: IC1.30 43.43,46.6 v44.13,46.99 | IC4.11 v61.59,19.05
  Bottom 0.254: v44.13,46.99 43.81,46.67 43.81,36.83 v61.59,19.05
TXD2
  Top 0.254: IC1.12 45.93,17.57 46.38,17.11 DD1.1.8
VBAT  (1 unrouted)
VDDA
  Top 0.254: L1.2 C5.1 43.94,24.26 44.43,24.75 IC1.9
VSSA
  Top 0.254: L2.2 C5.2 42.42,24 43.93,25.52 IC1.8